# EAGLE schematic sensor_v5 (EAGLE 7.2.0)
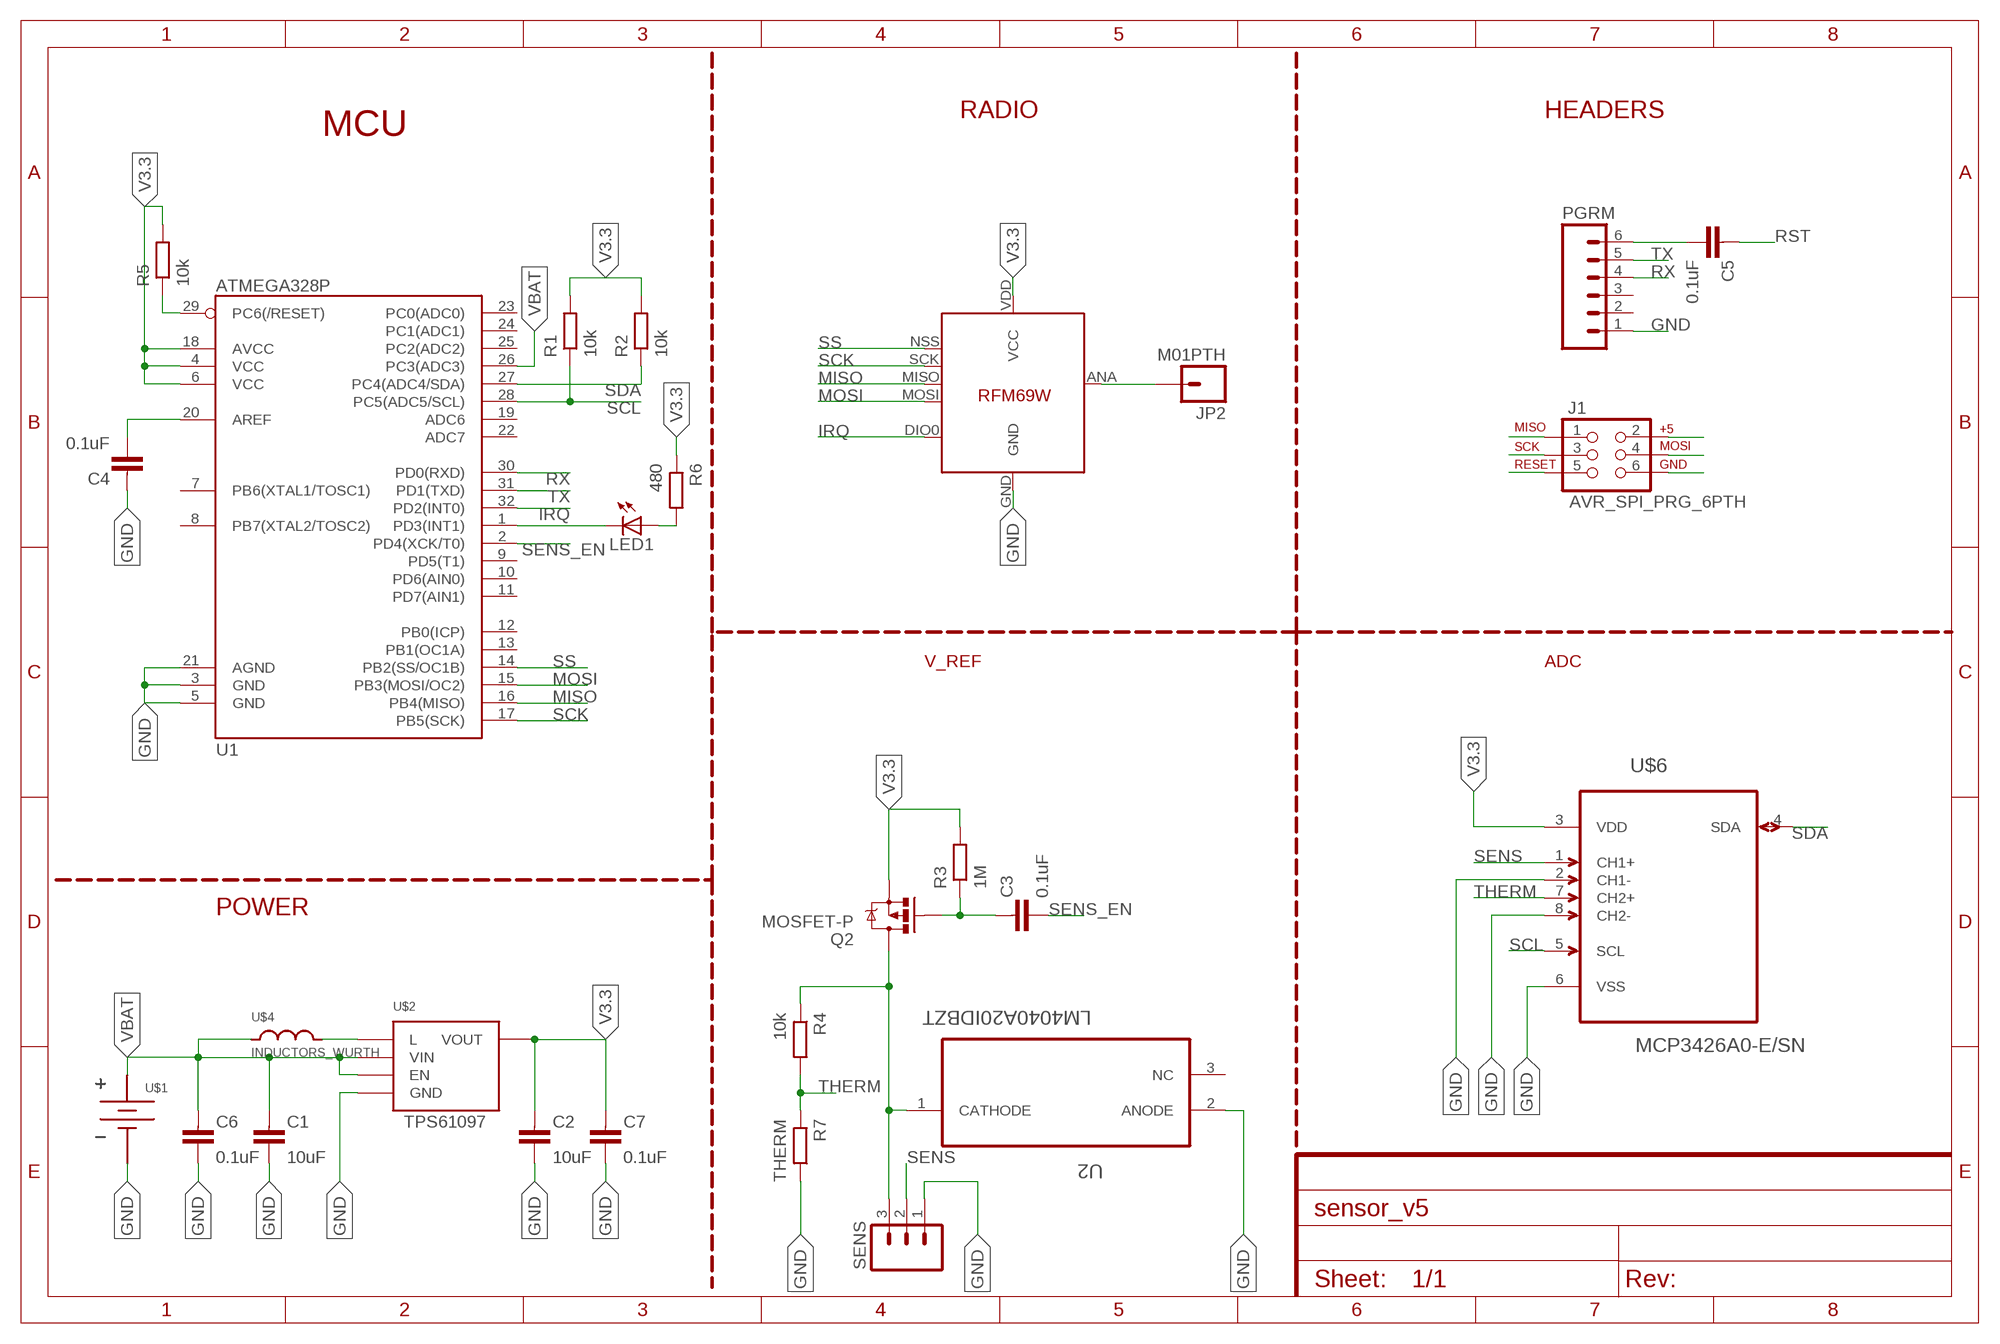
[diagram p0: schematic, sheet 1]

## Parts
C1  10uF  CAPACITOR0805-N  [C0805-N]
C2  10uF  CAPACITOR0805-N  [C0805-N]
C3  0.1uF  CAPACITOR0603-N  [C0603-N]
C4  0.1uF  CAPACITOR0603-N  [C0603-N]
C5  0.1uF  CAPACITOR0603-N  [C0603-N]
C6  0.1uF  CAPACITOR0603-N  [C0603-N]
C7  0.1uF  CAPACITOR0603-N  [C0603-N]
J1  AVR_SPI_PRG_6PTH  [2X3]
JP2  M01PTH  [1X01]
LED1  LED0603  [LED-0603]
PGRM  M06LONGPADS  [1X06_LONGPADS]
Q2  MOSFET-P  MOSFET-PCHANNELIRLML2244  [SOT23-3]
R1  10k  RESISTOR0603-N  [R0603-N]
R2  10k  RESISTOR0603-N  [R0603-N]
R3  1M  RESISTOR0603-N  [R0603-N]
R4  10k  RESISTOR0603-N  [R0603-N]
R5  10k  RESISTOR0603-N  [R0603-N]
R6  480  RESISTOR0603-N  [R0603-N]
R7  THERM  RESISTOR0603-N  [R0603-N]
SENS  M03PTH  [1X03]
U1  ATMEGA328P  ATMEGA328_SMT  [TQFP32-08]
U2  LM4040A20IDBZT  [SOT95P237X112-3N]
U$1  KEYSTONEAAHOLDER_2CELL  [KEYSTONEAAHOLDER_2CELL]
U$2  TPS61097-33  [SOT23-5]
U$4  INDUCTORS_WURTH  [WURTH_10UH_650MA]
U$5  RFM69  [RFM69W-MINPADS]
U$6  MCP3426A0-E/SN  [SOIC127P600X175-8N]

## Nets
G: C3.1 Q2.1(G) R3.1
GND: C1.2 C2.2 C4.1 C6.2 C7.2 J1.6 PGRM.1 R7.2 SENS.1 U1.3(GND) U1.5(GND) U1.21(AGND) U2.2(ANODE) U$1.P$2(GND) U$2.P$2(GND) U$5.GND U$6.2(CH1-) U$6.6(VSS) U$6.8(CH2-)
IRQ: U1.32(PD2(INT0)) U$5.DIO0
MISO: J1.1 U1.16(PB4(MISO)) U$5.MISO
MOSI: J1.4 U1.15(PB3(MOSI/OC2)) U$5.MOSI
N$1: U$2.P$5(L) U$4.P$1
N$4: C4.2 U1.20(AREF)
N$5: LED1.C U1.1(PD3(INT1))
N$7: JP2.1 U$5.ANA(ANT)
N$9: LED1.A R6.2
N$10: C5.2 PGRM.6
RST: C5.1 J1.5 R5.1 U1.29(PC6(/RESET))
RX: PGRM.4 U1.30(PD0(RXD))
SCK: J1.3 U1.17(PB5(SCK)) U$5.SCK
SCL: R1.1 U1.28(PC5(ADC5/SCL)) U$6.5(SCL)
SDA: R2.1 U1.27(PC4(ADC4/SDA)) U$6.4(SDA)
SENS: SENS.2 U$6.1(CH1+)
SENS_EN: C3.2 U1.2(PD4(XCK/T0))
SS: U1.14(PB2(SS/OC1B)) U$5.NSS(SEL)
THERM: R4.2 R7.1 U$6.7(CH2+)
TX: PGRM.5 U1.31(PD1(TXD))
V3.3: C2.1 C7.1 J1.2 Q2.2(S) R1.2 R2.2 R3.2 R5.2 R6.1 U1.4(VCC) U1.6(VCC) U1.18(AVCC) U$2.P$4(VOUT) U$5.VDD(VCC) U$6.3(VDD)
V_REF: Q2.3(D) R4.1 SENS.3 U2.1(CATHODE)
VBAT: C1.1 C6.1 U1.26(PC3(ADC3)) U$1.P$1(VBAT) U$2.P$1(VIN) U$2.P$3(EN) U$4.P$2
Unconnected: PGRM.2 PGRM.3 U1.7(PB6(XTAL1/TOSC1)) U1.8(PB7(XTAL2/TOSC2)) U1.9(PD5(T1)) U1.10(PD6(AIN0)) U1.11(PD7(AIN1)) U1.12(PB0(ICP)) U1.13(PB1(OC1A)) U1.19(ADC6) U1.22(ADC7) U1.23(PC0(ADC0)) U1.24(PC1(ADC1)) U1.25(PC2(ADC2)) U2.3(NC)

## Notes on the sheet
- RADIO | HEADERS
- MCU
- V_REF | ADC
- POWER

## Library data of the parts
C1-C7 = passives-7351:CAPACITOR
J1 = SparkFun-Connectors:AVR_SPI_PRG_6: AVR ISP 6 Pin This is the reduced ISP connector for AVR programming. Common on Arduino. This footprint will take up less PCB space and can be used with a 10-pin to 6-pin adapter such as SKU: BOB-08508
JP2 = SparkFun-Connectors:M01: Header 1 Standard 1-pin 0.1" header. Use with straight break away headers (SKU : PRT-00116), right angle break away headers (PRT-00553), swiss pins (PRT-00743), machine pins (PRT-00117), and female headers (PRT-00115).
LED1 = SparkFun-LED:LED: LEDs Standard schematic elements and footprints for 5mm, 3mm, 1206, and 0603 sized LEDs. 5mm - Spark Fun Electronics SKU : COM-00529 (and others)
PGRM = SparkFun-Connectors:M06: Header 6 Standard 6-pin 0.1" header. Use with straight break away headers (SKU : PRT-00116), right angle break away headers (PRT-00553), swiss pins (PRT-00743), machine pins (PRT-00117), and female headers (PRT-00115). Molex polarized connector foot print use with SKU : PRT-08094 with associated crimp pins and housings. NOTES ON THE VARIANTS LOCK and LOCK_LONGPADS... This footprint was designed to help hold the alignment of a through-hole component (i.e. 6-pin header) while soldering it into place. You may notice that each hole has been shifted either up or down by 0.005 of an inch from it's more standard position (which is a perfectly straight line). This slight alteration caused the pins (the squares in the middle) to touch the edges of the holes. Because they are alternating, it causes a "brace" to hold the component in place. 0.005 has proven to be the perfect amount of "off-center" position when using our standard breakaway headers. Although looks a little odd when you look at the bare footprint, once you have a header in there, the alteration is very hard to notice. Also,if you push a header all the way into place, it is covered up entirely on the bottom side. This idea of altering the position of holes to aid alignment will be further integrated into the Sparkfun Library for other footprints. It can help hold any component with 3 or more connection pins.
Q2 = SparkFun-DiscreteSemi:MOSFET-PCHANNEL: Generic PMOSFET IRLML2244 - TRANS-11153 (SOT-23 -20V -4.3A) (1.Gate 2.Source 3.Drain) FQP27P06 - COM-10349 <http://www.sparkfun.com/products/10349> (TO-220 -60V -27A) (1.Gate 2.Source 3.Drain); PROD_ID: TRANS-11153
R1-R7 = passives-7351:RESISTOR
SENS = SparkFun-Connectors:M03: Header 3 Standard 3-pin 0.1" header. Use with straight break away headers (SKU : PRT-00116), right angle break away headers (PRT-00553), swiss pins (PRT-00743), machine pins (PRT-00117), and female headers (PRT-00115). Molex polarized connector foot print use with SKU : PRT-08232 with associated crimp pins and housings.
U1 = SparkFun-DigitalIC:ATMEGA328_SMT: 32-Pin Atmega328 part Commonly used on Arduino compatible boards Available in QFP and QFN packages TQFP is IC-09069 QFN is non-stock; PROD_ID: IC-09069
U2 = Texas Instruments_By_element14_Batch_1:LM4040A20IDBZT: PRECISION MICROPOWER SHUNT VOLTAGE REFERENCE; MPN: LM4040A20IDBZT; OC_FARNELL: 1702826; OC_NEWARK: 53K9321; PACKAGE: 3-SOT-23; SUPPLIER: TEXAS INSTRUMENTS
U$1 = _my-parts:KEYSTONEAAHOLDER_2CELL
U$2 = _my-parts:TPS61097-33
U$4 = _my-parts:INDUCTORS
U$5 = LowPowerLab:RFM69
U$6 = Microchip_By_element14_Batch_1:MCP3426A0-E/SN: Analog-to-Digital Converter; MPN: MCP3426A0-E/SN; OC_FARNELL: 1825012; OC_NEWARK: 52R9954; PACKAGE: SOIC-8; SUPPLIER: Microchip